# EAGLE board Magus (EAGLE 9.4.0), part 1 of 2
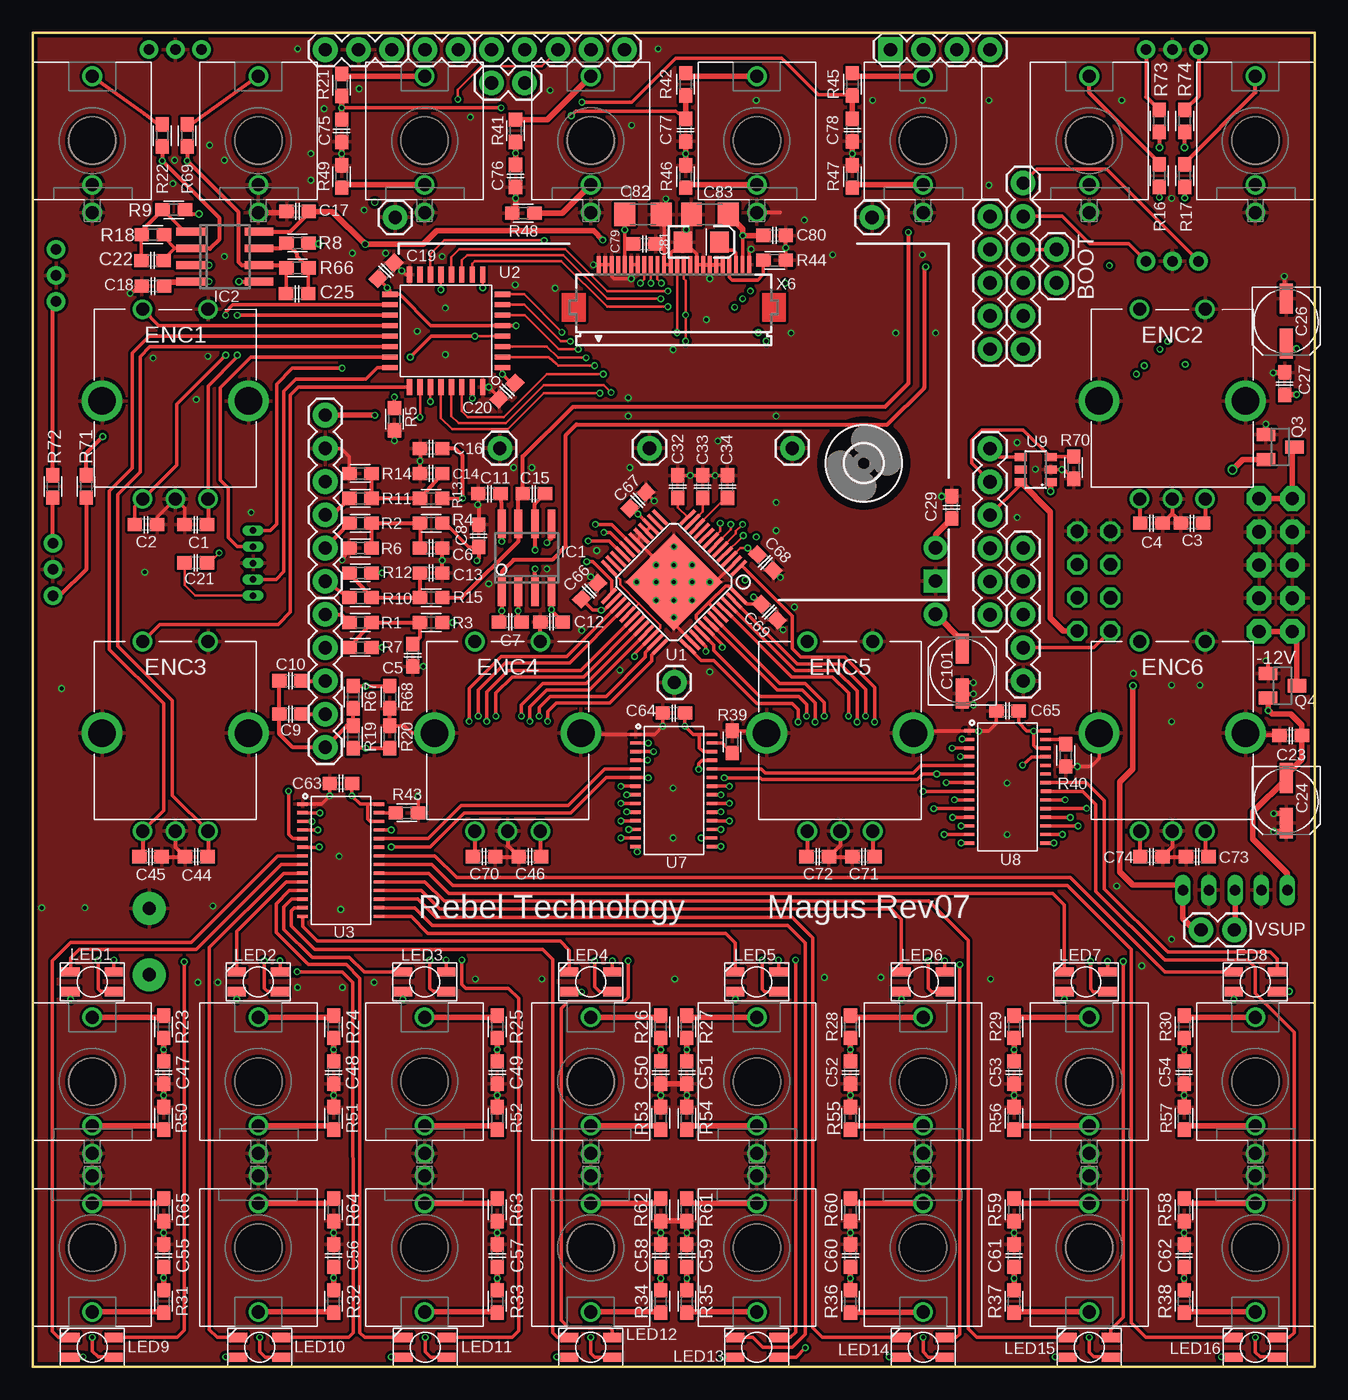
[diagram p2: board, top side]
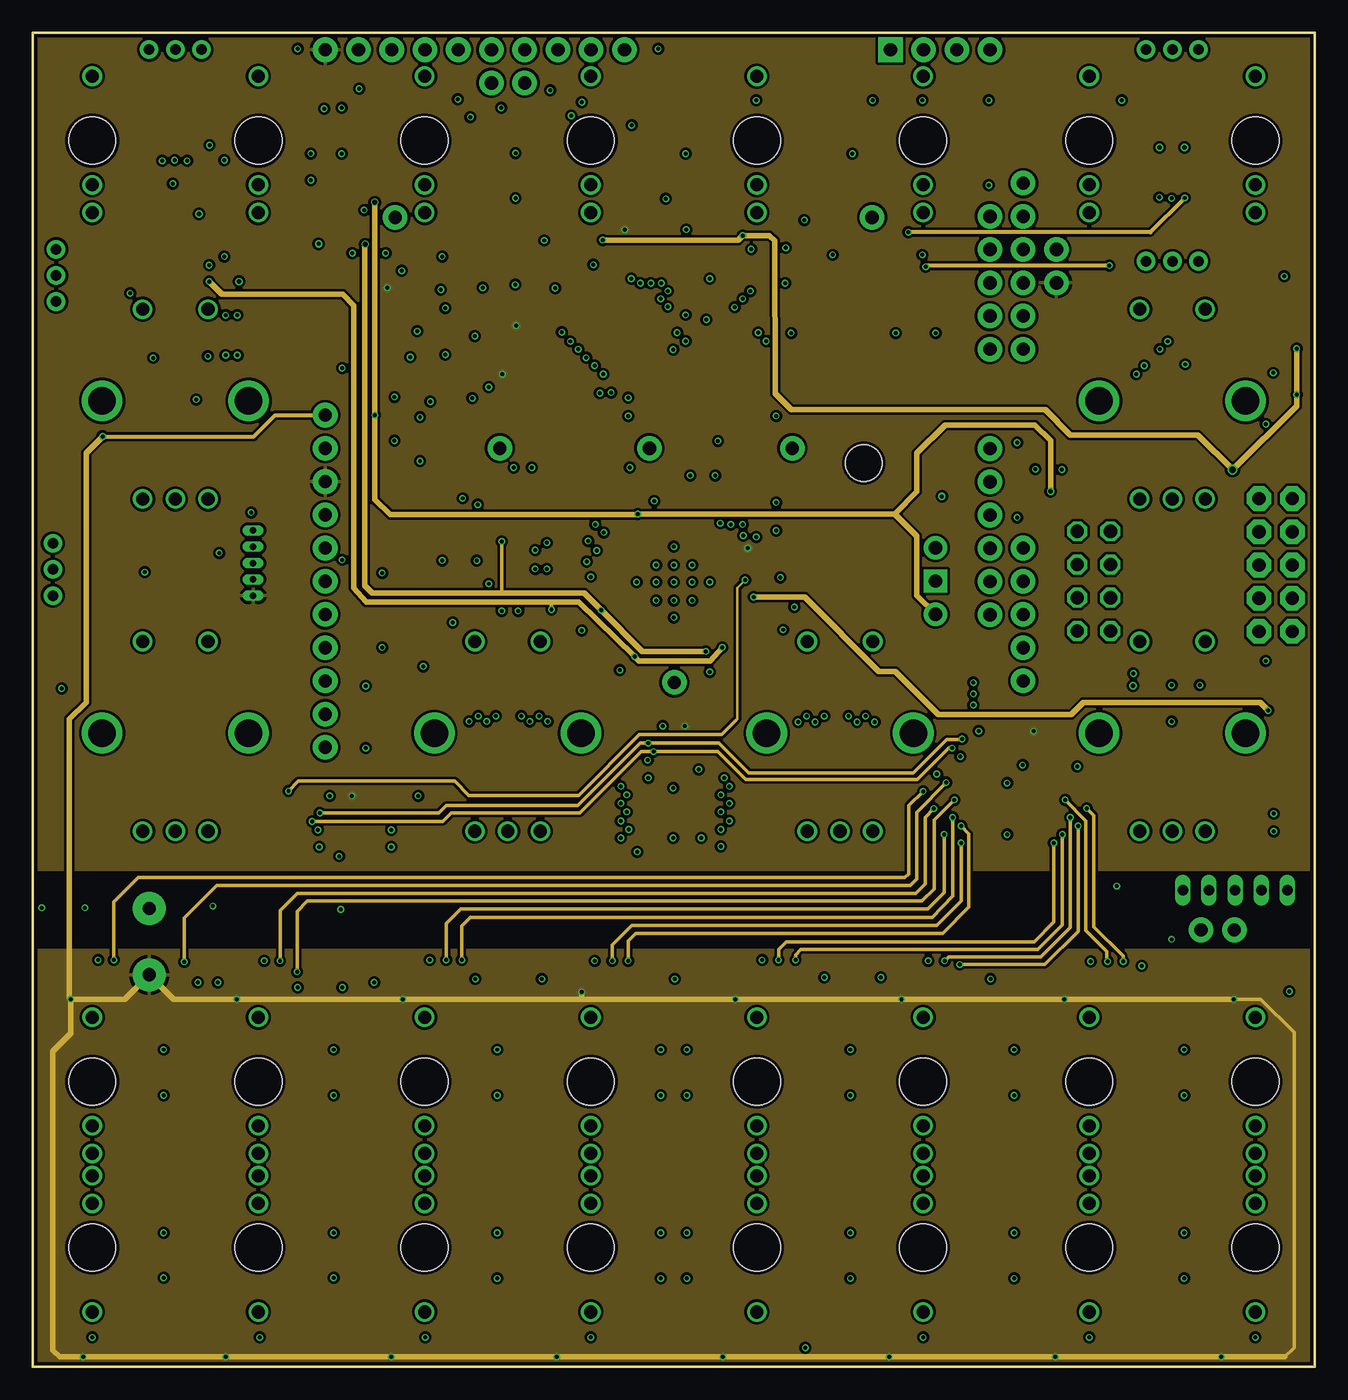
[diagram p3: board, inner layer InnerTop]
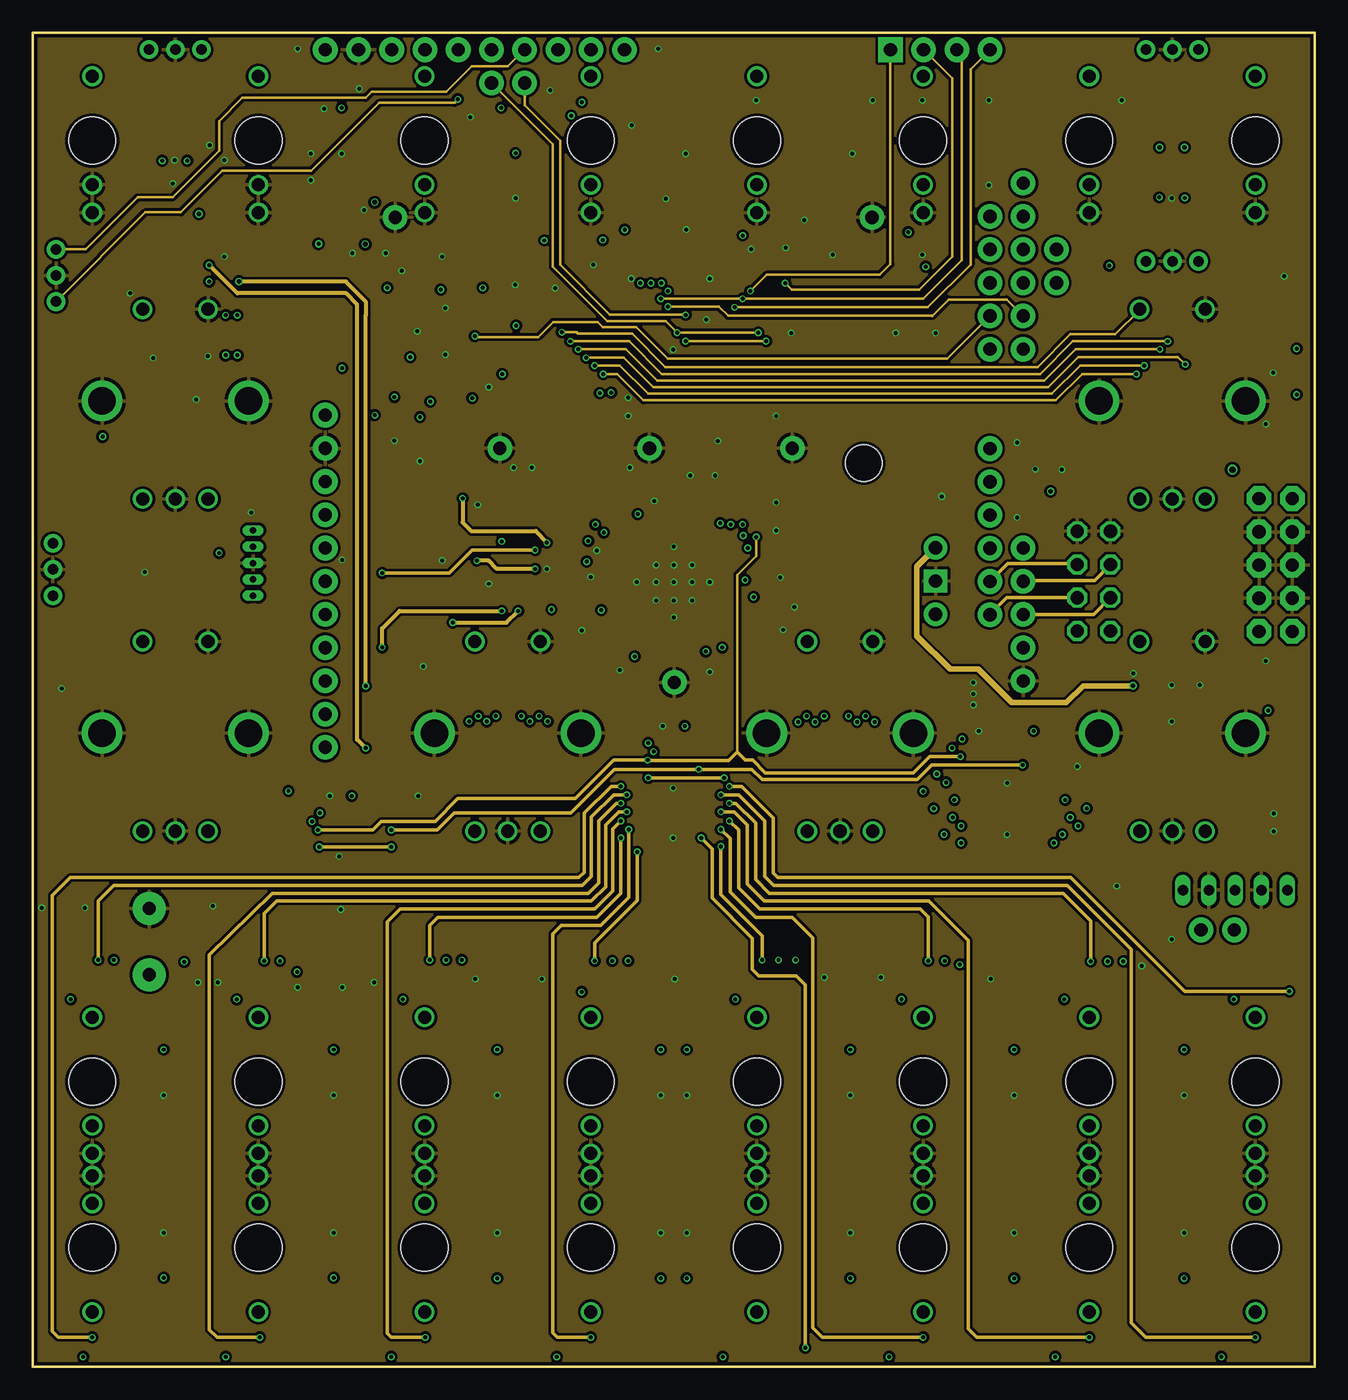
[diagram p4: board, inner layer InnerBottom]
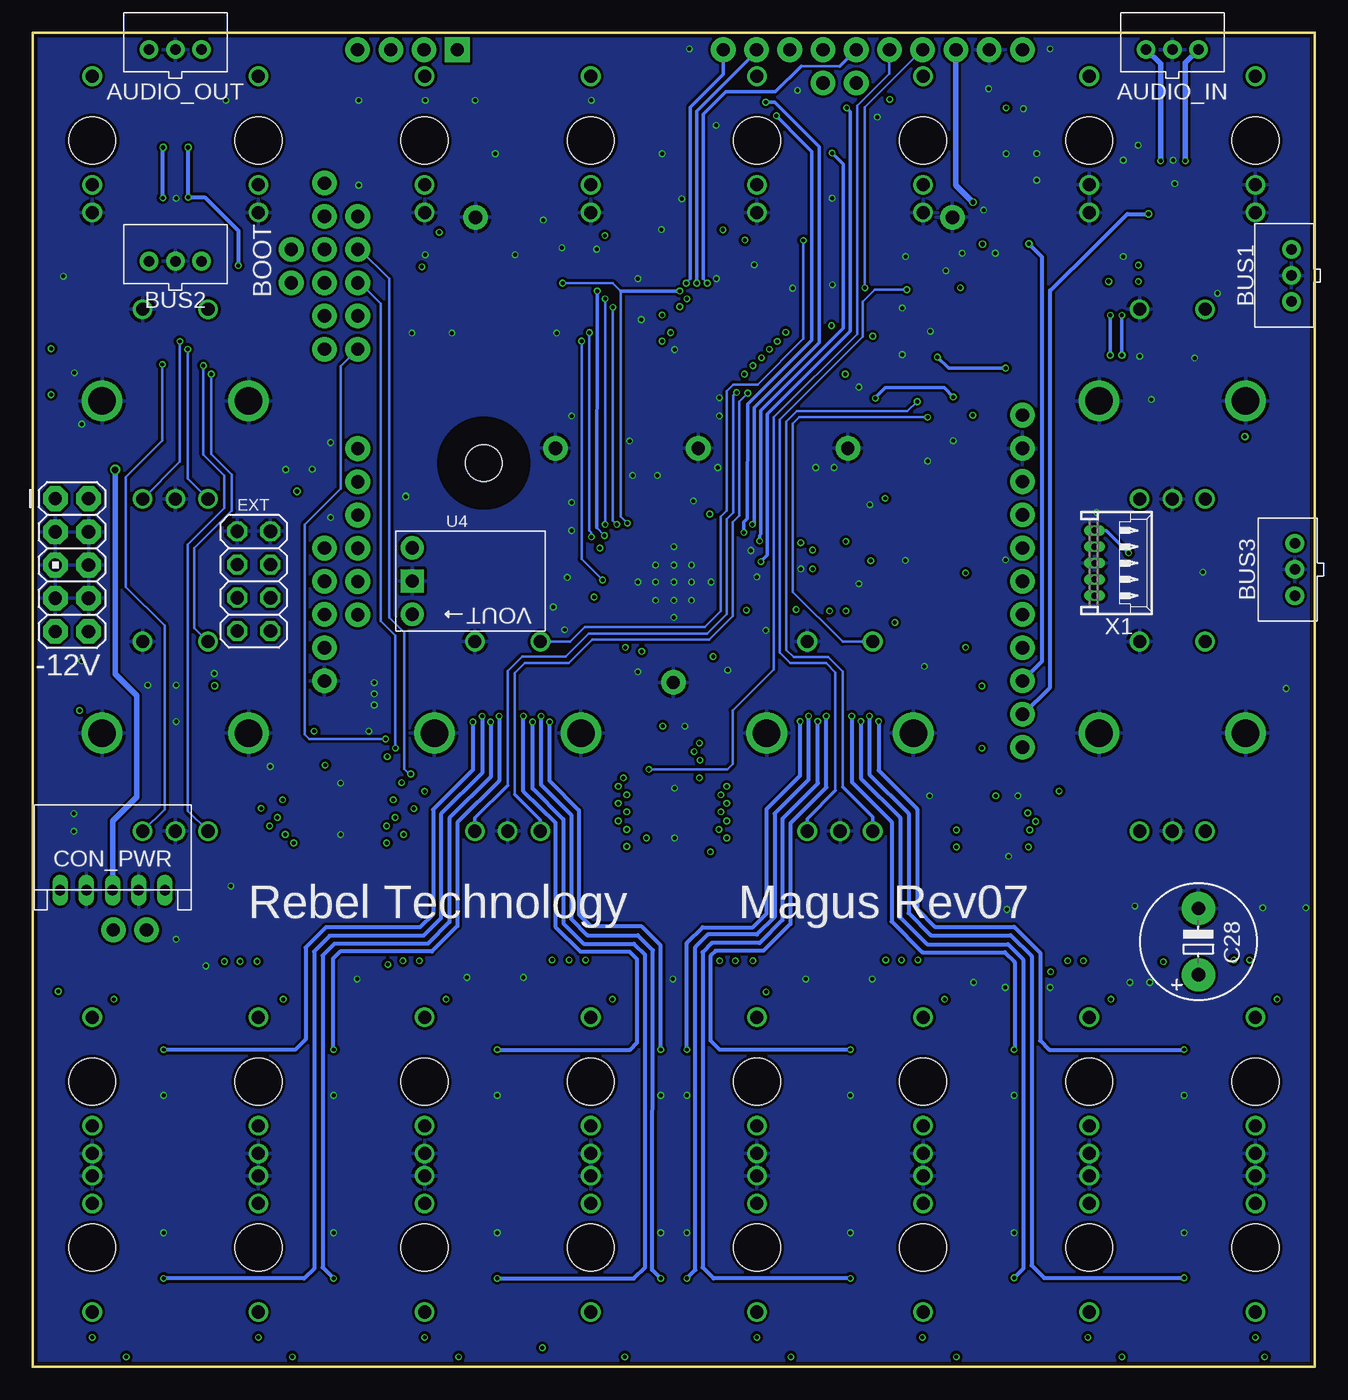
[diagram p5: board, bottom side, seen from below]

Size 98 x 102 mm. Coordinates in mm from the lower left corner, seen from the top.
Outline: 0,0 98,0 98,102 0,102 0,0
Copper layers (1*2*15*16): Top 0.035mm / dielectric 0.2mm / InnerTop 0.0175mm / dielectric 0.3mm / InnerBottom 0.0175mm / dielectric 0.2mm / Bottom 0.035mm
Design rules "SeeedStudio_4layer_DRU_no_angle_20140221": minimum track width 8mil, minimum drill 12mil, track to track 8mil, track to pad 8mil, pad to pad 8mil, via to via 8mil, smd to smd 0mil, copper to edge 10mil, drill to drill 8mil, minimum pad ring 6mil, minimum via ring 4mil, stop-mask expansion 4mil, vias tented up to drill 25mil, thermal gap 10mil
Net classes: 1 power: width 0.178 mm, drill 0.305 mm, clearance 0.178 mm to class 0, clearance 0.178 mm

## Footprints (pad centres in the part's own frame; a part is rotated, then mirrored left to right if it is on the bottom)
1X06 = drill 1.016 pad 1.88: 1 0,0; 2 2.54,0; 3 5.08,0; 4 7.62,0; 5 10.16,0; 6 12.7,0
1X05 = drill 1.016 pad 1.88: 1 0,0; 2 2.54,0; 3 5.08,0; 4 7.62,0; 5 10.16,0
JST-B3B-PH-KL = drill 0.8 pad 1.422: 1 2,0; 2 0,0; 3 -2,0
1X02 = drill 1.016 pad 1.88: 1 0,0; 2 2.54,0
C0603 = smd 1.1 x 1: 1 -0.85,0; 2 0.85,0
CPOL-5 = smd 2.3 x 1: + 1.725,0; - -1.725,0
E5-8,5 = drill 1.016 pad 2.54: + -2.54,0; - 2.54,0
EIA3216 = smd 1.4 x 1.6: A 1.4,0; C -1.4,0
C1206 = smd 1.6 x 1.8: 1 -1.4,0; 2 1.4,0
CON-JST_PH_5W = drill 0.8 long: P1 0,0; P2 -2,0; P3 -4,0; P4 -6,0; P5 -8,0
EC12E2424407 = drill 1: C 0,-7.5; PINA -2.5,-7.5; PINB 2.5,-7.5; SWITCH1 -2.5,7; SWITCH2 2.5,7 | drill 2.1: P$1 -5.6,0; P$2 5.6,0
2X04 = drill 1.016 octagon: 1 -3.81,-1.27; 2 -3.81,1.27; 3 -1.27,-1.27; 4 -1.27,1.27; 5 1.27,-1.27; 6 1.27,1.27; 7 3.81,-1.27; 8 3.81,1.27
1X04 = drill 1.016 pad 1.88 square: 1 0,0 | drill 1.016 pad 1.88: 2 2.54,0; 3 5.08,0; 4 7.62,0
SO08 = smd 0.6 x 2.2: 1 -1.905,-2.6; 2 -0.635,-2.6; 3 0.635,-2.6; 4 1.905,-2.6; 5 1.905,2.6; 6 0.635,2.6; 7 -0.635,2.6; 8 -1.905,2.6
THONKICONN = drill 1: P$1 0,-5.5; P$2 0,-3.38; P$3 0,4.92 | hole 3.6: 0,0
1X01 = drill 1.016 pad 1.88: 1 0,0
AVR_ICSP = drill 1.016 pad 1.88 octagon: 1 -1.27,5.08; 2 1.27,5.08; 3 -1.27,2.54; 4 1.27,2.54; 5 -1.27,0; 6 1.27,0; 7 -1.27,-2.54; 8 1.27,-2.54; 9 -1.27,-5.08; 10 1.27,-5.08
RGB-LED-703-1028 = smd 0.7 x 1.4: P1 -0.75,1.65; P2 -0.75,-1.65; P3 0.75,-1.65; P4 0.75,1.65
1X03 = drill 1.016 pad 1.88: 1 0,0; 2 2.54,0; 3 5.08,0
SOT23 = smd 1 x 1.4: 1 -0.95,-1.1; 2 0.95,-1.1; 3 0,1.1
0603 = smd 1.1 x 1: 1 -0.85,0; 2 0.85,0
TQFP48 = smd 0.27 x 1.55: 1 -2.75,-4.25; 2 -2.25,-4.25; 3 -1.75,-4.25; 4 -1.25,-4.25; 5 -0.75,-4.25; 6 -0.25,-4.25; 7 0.25,-4.25; 8 0.75,-4.25; 9 1.25,-4.25; 10 1.75,-4.25; 11 2.25,-4.25; 12 2.75,-4.25; 25 2.75,4.25; 26 2.25,4.25; 27 1.75,4.25; 28 1.25,4.25; 29 0.75,4.25; 30 0.25,4.25; 31 -0.25,4.25; 32 -0.75,4.25; 33 -1.25,4.25; 34 -1.75,4.25; 35 -2.25,4.25; 36 -2.75,4.25 | smd 1.55 x 0.27: 13 4.25,-2.75; 14 4.25,-2.25; 15 4.25,-1.75; 16 4.25,-1.25; 17 4.25,-0.75; 18 4.25,-0.25; 19 4.25,0.25; 20 4.25,0.75; 21 4.25,1.25; 22 4.25,1.75; 23 4.25,2.25; 24 4.25,2.75; 37 -4.25,2.75; 38 -4.25,2.25; 39 -4.25,1.75; 40 -4.25,1.25; 41 -4.25,0.75; 43 -4.25,-0.25; 44 -4.25,-0.75; 45 -4.25,-1.25; 46 -4.25,-1.75; 47 -4.25,-2.25; 48 -4.25,-2.75 | smd 1.5 x 0.3: 42 -4.25,0.25 | smd 5.22 x 5.22: EP 0,0
LQFP32-7X7 = smd 1.2 x 0.4: 1 -4.3,2.8; 2 -4.3,2; 3 -4.3,1.2; 4 -4.3,0.4; 5 -4.3,-0.4; 6 -4.3,-1.2; 7 -4.3,-2; 8 -4.3,-2.8; 17 4.3,-2.8; 18 4.3,-2; 19 4.3,-1.2; 20 4.3,-0.4; 21 4.3,0.4; 22 4.3,1.2; 23 4.3,2; 24 4.3,2.8 | smd 0.4 x 1.2: 9 -2.8,-4.3; 10 -2,-4.3; 11 -1.2,-4.3; 12 -0.4,-4.3; 13 0.4,-4.3; 14 1.2,-4.3; 15 2,-4.3; 16 2.8,-4.3; 25 2.8,4.3; 26 2,4.3; 27 1.2,4.3; 28 0.4,4.3; 29 -0.4,4.3; 30 -1.2,4.3; 31 -2,4.3; 32 -2.8,4.3
TSSOP28 = smd 0.8 x 0.25: 1 -2.921,4.623; 2 -2.921,3.962; 3 -2.921,3.302; 4 -2.921,2.642; 5 -2.921,1.981; 6 -2.921,1.321; 7 -2.921,0.66; 8 -2.927,0; 9 -2.921,-0.66; 10 -2.921,-1.321; 11 -2.921,-1.981; 12 -2.921,-2.642; 13 -2.921,-3.302; 14 -2.921,-3.962; 15 2.921,-3.962; 16 2.921,-3.302; 17 2.921,-2.642; 18 2.921,-1.981; 19 2.921,-1.321; 20 2.921,-0.66; 21 2.927,0; 22 2.921,0.66; 23 2.921,1.321; 24 2.921,1.981; 25 2.921,2.642; 26 2.921,3.302; 27 2.921,3.962; 28 2.921,4.623
REG_S9V11F5 = drill 1.016 pad 1.778 square: GND 0,0 | drill 1.016 pad 1.778: VIN -2.54,0; VOUT 2.54,0
SOT23-6 = smd 0.6 x 0.9: 1 -0.95,-1.15; 2 0,-1.15; 3 0.95,-1.15; 4 0.95,1.15; 5 0,1.15; 6 -0.95,1.15
2,8 = hole 2.8: 0,0
53048-05 = drill 0.5 pad 0.698 long: 1 2.5,-1.25; 2 1.25,-1.25; 3 0,-1.25; 4 -1.25,-1.25; 5 -2.5,-1.25
FH12-24S-0.5SH = smd 0.3 x 1.3: 1 -5.75,3.25; 2 -5.25,3.25; 3 -4.75,3.25; 4 -4.25,3.25; 5 -3.75,3.25; 6 -3.25,3.25; 7 -2.75,3.25; 8 -2.25,3.25; 9 -1.75,3.25; 10 -1.25,3.25; 11 -0.75,3.25; 12 -0.25,3.25; 13 0.25,3.25; 14 0.75,3.25; 15 1.25,3.25; 16 1.75,3.25; 17 2.25,3.25; 18 2.75,3.25; 19 3.25,3.25; 20 3.75,3.25; 21 4.25,3.25; 22 4.75,3.25; 23 5.25,3.25; 24 5.75,3.25

## Placement (x,y rotation side)
ANG1  [1X06]  22.36,72.76 270 top
ANG2  [1X05]  22.36,57.52 270 top
ANG3  [1X06]  75.7,77.8 90 top
AUDIO_IN  [JST-B3B-PH-KL]  10.9,100.71 0 bottom
AUDIO_OUT  [JST-B3B-PH-KL]  87.1,100.71 0 bottom
BOOT  [1X02]  78.24,82.88 90 top
BUS1  [JST-B3B-PH-KL]  1.79,83.44 90 bottom
BUS2  [JST-B3B-PH-KL]  87.1,84.53 0 bottom
BUS3  [JST-B3B-PH-KL]  1.54,60.96 90 bottom
C1  10n  [C0603]  12.46,64.39 0 top
C2  10n  [C0603]  8.65,64.39 180 top
C3  10n  [C0603]  88.6,64.5 0 top
C4  10n  [C0603]  85.5,64.5 180 top
C5  1n C0G  [C0603]  29.05,54.4 90 top
C6  1n C0G  [C0603]  30.45,62.6 0 top
C7  100p C0G  [C0603]  36.5,56.95 180 top
C8  100p C0G  [C0603]  34.08,63.54 90 top
C9  2n7 C0G  [C0603]  19.7,49.9 180 top
C10  2n7 C0G  [C0603]  19.7,52.45 180 top
C11  100n  [C0603]  34.9,66.75 180 top
C12  100n  [C0603]  39.65,56.95 180 top
C13  1n C0G  [C0603]  30.45,60.7 180 top
C14  1n C0G  [C0603]  30.45,68.3 180 top
C15  100p C0G  [C0603]  38.3,66.75 180 top
C16  100p C0G  [C0603]  30.45,70.2 180 top
C17  100n  [C0603]  20.25,88.33 180 top
C18  100n  [C0603]  9.19,82.62 180 top
C19  100n  [C0603]  27,83.8 45 top
C20  100n  [C0603]  36.25,74.6 225 top
C21  100n  [C0603]  12.46,61.47 0 top
C22  220p C0G  [C0603]  9.16,84.58 180 top
C23  100n  [C0603]  96.16,48.26 0 top
C24  47u  [CPOL-5]  95.8,43.29 270 top
C25  220p C0G  [C0603]  20.21,82.04 0 top
C26  47u  [CPOL-5]  95.8,79.94 270 top
C27  100n  [C0603]  95.68,75.17 90 top
C28  100u  [E5-8,5]  8.91,32.51 90 bottom
C29  100n  [C0603]  70.23,65.72 90 top
C32  4u7  [C0603]  49.3,67.3 90 top
C33  4u7  [C0603]  51.2,67.3 90 top
C34  4u7  [C0603]  53.1,67.3 90 top
C44  10n  [C0603]  12.5,39 0 top
C45  10n  [C0603]  9,39 180 top
C46  10n  [C0603]  38,39 0 top
C47  100n  [C0603]  10,22.5 270 top
C48  100n  [C0603]  23,22.5 270 top
C49  100n  [C0603]  35.5,22.5 270 top
C50  100n  [C0603]  48,22.5 270 top
C51  100n  [C0603]  50,22.5 270 top
C52  100n  [C0603]  62.5,22.5 270 top
C53  100n  [C0603]  75,22.5 270 top
C54  100n  [C0603]  88,22.5 270 top
C55  100n  [C0603]  10,8.5 90 top
C56  100n  [C0603]  23,8.5 90 top
C57  100n  [C0603]  35.5,8.5 90 top
C58  100n  [C0603]  48,8.5 90 top
C59  100n  [C0603]  50,8.5 90 top
C60  100n  [C0603]  62.5,8.5 90 top
C61  100n  [C0603]  75,8.5 90 top
C62  100n  [C0603]  88,8.5 90 top
C63  100n  [C0603]  23.55,44.6 180 top
C64  100n  [C0603]  49,49.98 180 top
C65  100n  [C0603]  74.5,50.15 180 top
C66  100n  [C0603]  42.55,59.3 45 top
C67  100n  [C0603]  46.25,66.25 45 top
C68  100n  [C0603]  56,61.5 315 top
C69  100n  [C0603]  56.3,57.7 135 top
C70  10n  [C0603]  34.5,39 180 top
C71  10n  [C0603]  63.5,39 0 top
C72  10n  [C0603]  60,39 180 top
C73  10n  [C0603]  89,39 0 top
C74  10n  [C0603]  85.5,39 180 top
C75  100n  [C0603]  23.61,94.5 270 top
C76  100n  [C0603]  36.9,91.05 270 top
C77  100n  [C0603]  49.9,94.55 270 top
C78  100n  [C0603]  62.65,94.55 270 top
C79  100n  [C0603]  46.75,85.85 180 top
C80  100n  [C0603]  56.7,86.5 180 top
C81  4u7 16V Tantalum  [EIA3216]  51.1,86 0 top
C82  10u  [C1206]  46.65,88.1 180 top
C83  10u  [C1206]  51.75,88.1 0 top
C101  47u  [CPOL-5]  71.04,53.2 90 top
CON_PWR  CON-JST_PH_5W  [CON-JST_PH_5W]  87.9,36.45 0 bottom
ENC1  EC12E2424407  [EC12E2424407]  10.9,73.85 0 top
ENC2  EC12E2424407  [EC12E2424407]  87.1,73.85 0 top
ENC3  EC12E2424407  [EC12E2424407]  10.9,48.45 0 top
ENC4  EC12E2424407  [EC12E2424407]  36.3,48.45 0 top
ENC5  EC12E2424407  [EC12E2424407]  61.7,48.45 0 top
ENC6  EC12E2424407  [EC12E2424407]  87.1,48.45 0 top
EXT  [2X04]  81.1,60.07 90 bottom
EXTSPI  [1X04]  65.55,100.7 0 top
IC1  NE5532D  [SO08]  37.75,61.85 0 top
IC2  NE5532D  [SO08]  14.69,84.87 270 top
INL  THONKICONN  [THONKICONN]  4.55,93.75 0 top
INR  THONKICONN  [THONKICONN]  17.25,93.75 0 top
J1  [1X01]  64.15,87.88 0 top
J2  [1X01]  58.05,70.23 0 top
J3  [1X01]  47.13,70.23 0 top
J4  [1X01]  35.7,70.23 90 top
J5  [1X01]  27.7,87.88 90 top
J6  [1X01]  49.04,52.32 0 top
JP2  M05X2PTH  [AVR_ICSP]  95,61.3 0 bottom
LED1  ASMB-MTB1-0A3A2  [RGB-LED-703-1028]  4.55,29.43 270 top
LED2  ASMB-MTB1-0A3A2  [RGB-LED-703-1028]  17.25,29.43 270 top
LED3  ASMB-MTB1-0A3A2  [RGB-LED-703-1028]  29.95,29.43 270 top
LED4  ASMB-MTB1-0A3A2  [RGB-LED-703-1028]  42.65,29.43 270 top
LED5  ASMB-MTB1-0A3A2  [RGB-LED-703-1028]  55.35,29.43 270 top
LED6  ASMB-MTB1-0A3A2  [RGB-LED-703-1028]  68.05,29.43 270 top
LED7  ASMB-MTB1-0A3A2  [RGB-LED-703-1028]  80.5,29.43 270 top
LED8  ASMB-MTB1-0A3A2  [RGB-LED-703-1028]  93.45,29.43 270 top
LED9  ASMB-MTB1-0A3A2  [RGB-LED-703-1028]  4.55,1.49 270 top
LED10  ASMB-MTB1-0A3A2  [RGB-LED-703-1028]  17.35,1.49 270 top
LED11  ASMB-MTB1-0A3A2  [RGB-LED-703-1028]  30,1.49 270 top
LED12  ASMB-MTB1-0A3A2  [RGB-LED-703-1028]  42.65,1.49 270 top
LED13  ASMB-MTB1-0A3A2  [RGB-LED-703-1028]  55.35,1.49 270 top
LED14  ASMB-MTB1-0A3A2  [RGB-LED-703-1028]  68.05,1.49 270 top
LED15  ASMB-MTB1-0A3A2  [RGB-LED-703-1028]  80.75,1.49 270 top
LED16  ASMB-MTB1-0A3A2  [RGB-LED-703-1028]  93.45,1.49 270 top
LGP1-5  [1X05]  35.06,100.7 0 top
LGP6-1  [1X02]  35.06,98.16 0 top
LGP6-7  [1X02]  29.98,100.7 0 top
OUTL  THONKICONN  [THONKICONN]  80.75,93.75 0 top
OUTR  THONKICONN  [THONKICONN]  93.45,93.75 0 top
P1  THONKICONN  [THONKICONN]  4.55,21.81 0 top
P2  THONKICONN  [THONKICONN]  17.25,21.81 0 top
P3  THONKICONN  [THONKICONN]  29.95,21.81 0 top
P4  THONKICONN  [THONKICONN]  42.65,21.81 0 top
P5  THONKICONN  [THONKICONN]  55.35,21.81 0 top
P6  THONKICONN  [THONKICONN]  68.05,21.81 0 top
P7  THONKICONN  [THONKICONN]  80.75,21.81 0 top
P8  THONKICONN  [THONKICONN]  93.45,21.81 0 top
P9  THONKICONN  [THONKICONN]  4.55,9.11 180 top
P10  THONKICONN  [THONKICONN]  17.25,9.11 180 top
P11  THONKICONN  [THONKICONN]  29.95,9.11 180 top
P12  THONKICONN  [THONKICONN]  42.65,9.11 180 top
P13  THONKICONN  [THONKICONN]  55.35,9.11 180 top
P14  THONKICONN  [THONKICONN]  68.05,9.11 180 top
P15  THONKICONN  [THONKICONN]  80.75,9.11 180 top
P16  THONKICONN  [THONKICONN]  93.45,9.11 180 top
P17  THONKICONN  [THONKICONN]  29.95,93.75 0 top
P18  THONKICONN  [THONKICONN]  42.65,93.75 0 top
P19  THONKICONN  [THONKICONN]  55.35,93.75 0 top
P20  THONKICONN  [THONKICONN]  68.05,93.75 0 top
PWR  [1X03]  27.44,100.7 180 top
Q3  PMV65XPEA  [SOT23]  95.35,70.33 270 top
Q4  BSS123  [SOT23]  95.52,52.07 270 top
R1  4k7  [0603]  25.05,56.9 180 top
R2  4k7  [0603]  25.05,64.5 180 top
R3  4k7  [0603]  30.45,56.9 180 top
R4  4k7  [0603]  30.45,64.5 180 top
R5  10k  [0603]  27.65,72.45 90 top
R6  10k  [0603]  25.05,62.6 180 top
R7  10k  [0603]  25.05,55 180 top
R8  91R  [0603]  20.24,85.92 0 top
R9  91R  [0603]  10.78,88.46 0 top
R10  4k7  [0603]  25.05,58.8 180 top
R11  4k7  [0603]  25.05,66.4 180 top
R12  4k7  [0603]  25.05,60.7 180 top
R13  4k7  [0603]  30.45,66.4 180 top
R14  10k  [0603]  25.05,68.3 180 top
R15  10k  [0603]  30.45,58.8 180 top
R16  100R  [0603]  86.1,91.06 270 top
R17  100R  [0603]  88.05,91.06 270 top
R18  22k  [0603]  9.19,86.56 180 top
R19  22k  [0603]  24.5,48.15 270 top
R20  100k  [0603]  27.3,48.15 90 top
R21  1k  [0603]  23.61,98 270 top
R22  100k  [0603]  9.9,94.14 270 top
R23  1k  [0603]  10,26 270 top
R24  1k  [0603]  23,26 270 top
R25  1k  [0603]  35.5,26 270 top
R26  1k  [0603]  48,26 270 top
R27  1k  [0603]  50,26 270 top
R28  1k  [0603]  62.5,26 270 top
R29  1k  [0603]  75,26 270 top
R30  1k  [0603]  88,26 270 top
R31  1k  [0603]  10,5 90 top
R32  1k  [0603]  23,5 90 top
R33  1k  [0603]  35.5,5 90 top
R34  1k  [0603]  48,5 90 top
R35  1k  [0603]  50,5 90 top
R36  1k  [0603]  62.5,5 90 top
R37  1k  [0603]  75,5 90 top
R38  1k  [0603]  88,5 90 top
R39  2k2  [0603]  53.45,47.78 90 top
R40  2k2  [0603]  78.95,46.75 270 top
R41  1k  [0603]  36.9,94.5 270 top
R42  1k  [0603]  49.9,98.05 270 top
R43  2k2  [0603]  28.6,42.35 0 top
R44  560k  [0603]  56.7,84.6 180 top
R45  1k  [0603]  62.65,98.05 270 top
R46  10k  [0603]  49.9,91 90 top
R47  10k  [0603]  62.65,91 90 top
R48  10k  [0603]  37.5,88.2 180 top
R49  10k  [0603]  23.61,91 90 top
R50  10k  [0603]  10,19 90 top
R51  10k  [0603]  23,19 90 top
R52  10k  [0603]  35.5,19 90 top
R53  10k  [0603]  48,19 90 top
R54  10k  [0603]  50,19 90 top
R55  10k  [0603]  62.5,19 90 top
R56  10k  [0603]  75,19 90 top
R57  10k  [0603]  88,19 90 top
R58  10k  [0603]  88,12 270 top
R59  10k  [0603]  75,12 270 top
R60  10k  [0603]  62.5,12 270 top
R61  10k  [0603]  50,12 270 top
R62  10k  [0603]  48,12 270 top
R63  10k  [0603]  35.5,12 270 top
R64  10k  [0603]  23,12 270 top
R65  10k  [0603]  10,12 270 top
R66  22k  [0603]  20.24,84.02 0 top
R67  22k  [0603]  24.5,51.2 90 top
R68  100k  [0603]  27.3,51.2 270 top
R69  100k  [0603]  11.8,94.14 270 top
R70  10k  [0603]  79.56,68.74 270 top
R71  220R  [0603]  4.08,67.31 270 top
R72  220R  [0603]  1.54,67.31 270 top
R73  100R  [0603]  86.1,95.25 270 top
R74  100R  [0603]  88.05,95.25 270 top
U1  MAX11300GTLTQFP  [TQFP48]  49,60 135 top
U2  STM32F051K4T6  [LQFP32-7X7]  31.6,79.2 180 top
U3  TLC5946  [TSSOP28]  23.55,38.4 0 top
U4  REG_S9V11F5  [REG_S9V11F5]  69,60.08 270 bottom
U7  TLC5946  [TSSOP28]  49,43.73 0 top
U8  TLC5946  [TSSOP28]  74.5,44 0 top
U9  MIC2005  [SOT23-6]  76.66,68.59 90 top
U$1  [2,8]  63.52,69.09 0 top
USB1  [1X05]  73.16,77.8 90 top
USBD  [1X05]  75.7,62.6 270 top
USBH  [1X06]  73.16,57.5 90 top
VSUP  [1X02]  91.84,33.4 180 top
X1  53048-05  [53048-05]  15.6,61.45 270 bottom
X6  FH12-24S-0.5SH  [FH12-24S-0.5SH]  49,81 0 top